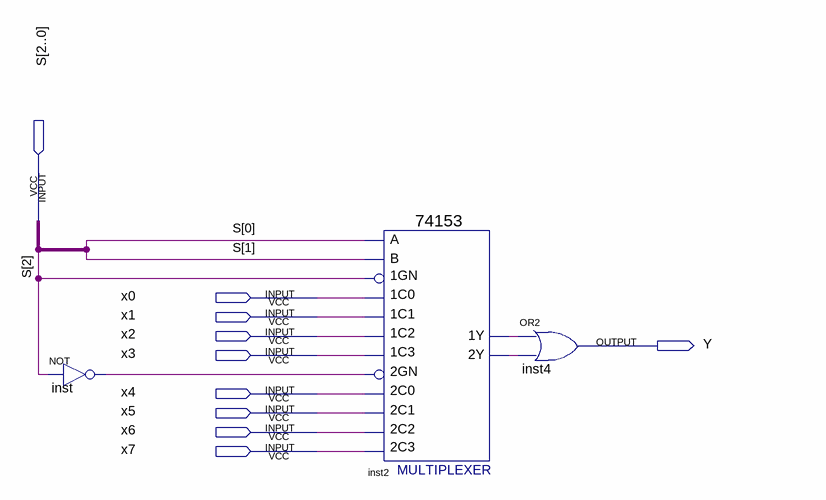
[diagram p0: schematic sheet]
// Quartus schematic Mux81.bdf as structural Verilog: 3 symbols, 10 pins
module Mux81 (
  input  [2:0] S,
  input  x0,
  input  x1,
  input  x2,
  input  x3,
  input  x4,
  input  x5,
  input  x6,
  input  x7,
  output Y
);

  wire inst2_1y, inst2_2y, inst_out;

  not inst (inst_out, S[2]);
  \74153  inst2 (
    .\1C1 (x1), .\1GN (S[2]), .\1C0 (x0), .\2C0 (x4), .\2GN (inst_out), .\2C2 (x6), .\1C2 (x2), .\1C3 (x3),
    .B(S[1]), .A(S[0]), .\2C1 (x5), .\2C3 (x7), .\1Y (inst2_1y), .\2Y (inst2_2y));
  or inst4 (Y, inst2_1y, inst2_2y);
endmodule
